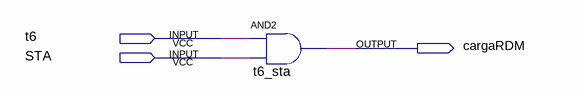
[diagram p0: schematic sheet]
// Quartus schematic carga_rdm.bdf as structural Verilog: 1 symbols, 3 pins
module carga_rdm (
  input  t6,
  input  STA,
  output cargaRDM
);

  and t6_sta (cargaRDM, t6, STA);
endmodule
